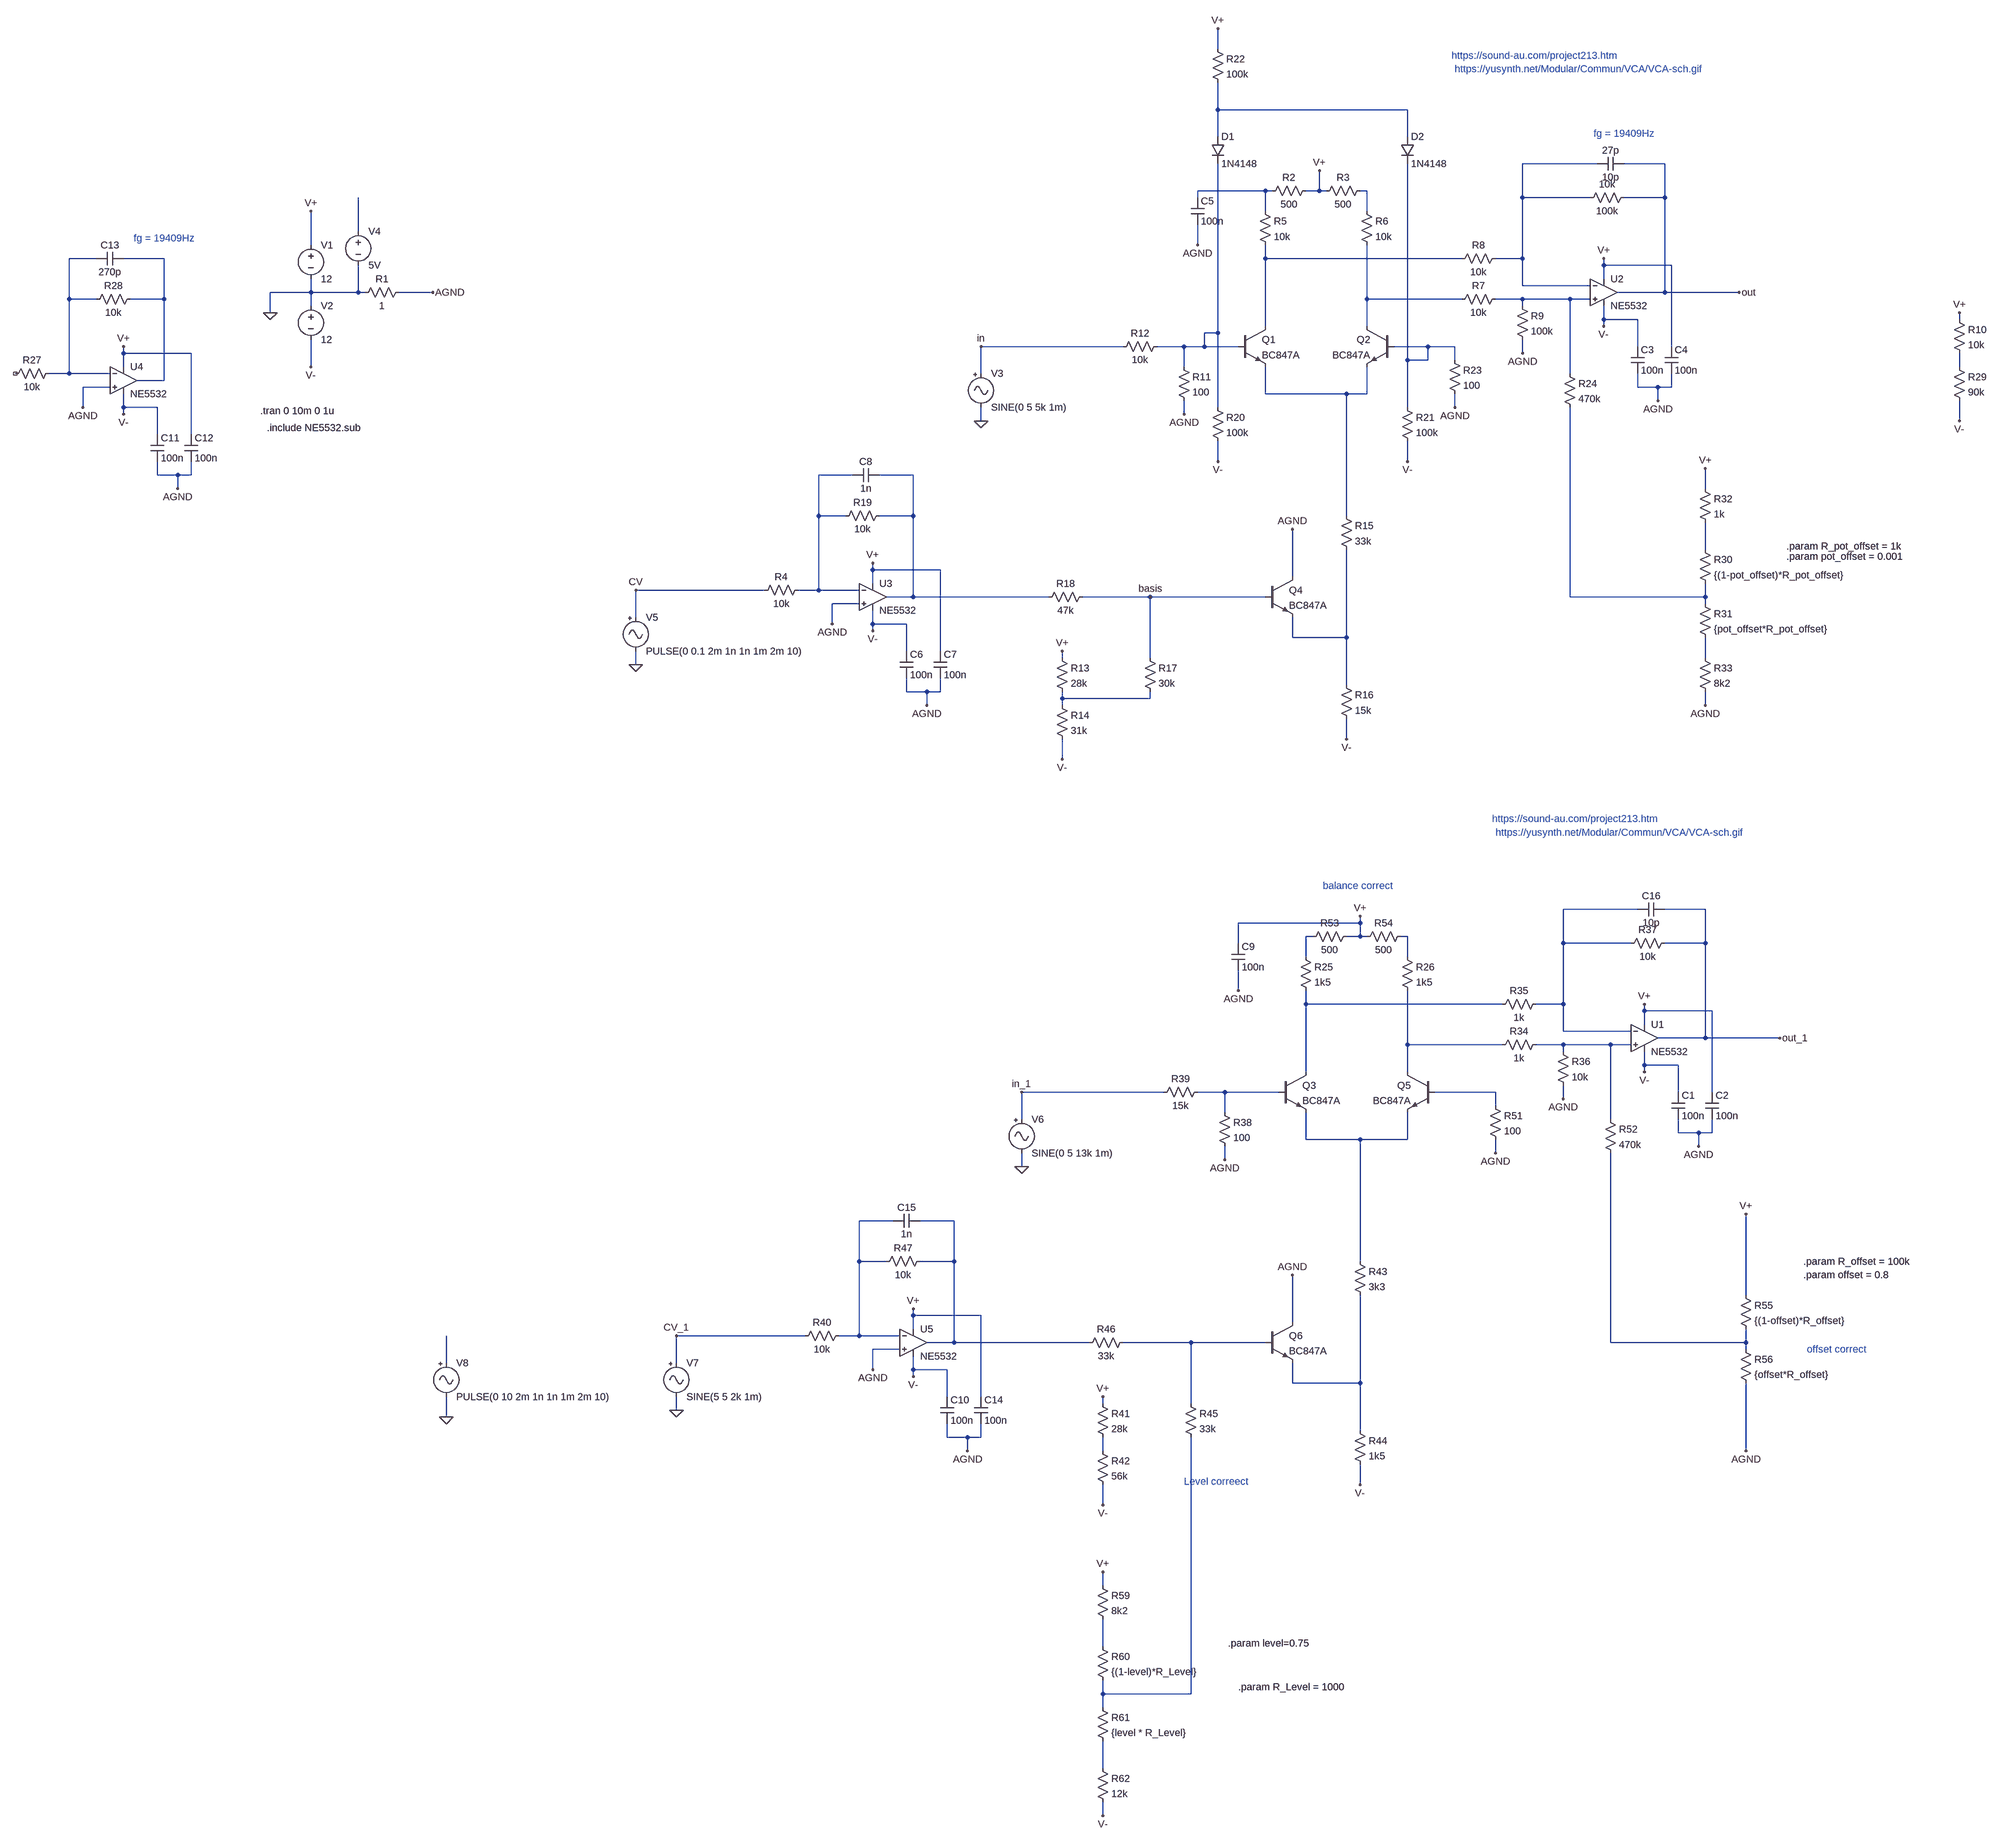
[diagram p0: schematic VCA.asc]
VCA.asc, the LTspice schematic file:
Version 4
SHEET 1 3684 4248
WIRE 1760 -416 1760 -464
WIRE 1760 -272 1760 -336
WIRE 2208 -272 1760 -272
WIRE 1760 -208 1760 -272
WIRE 2208 -208 2208 -272
WIRE 2656 -144 2480 -144
WIRE 2816 -144 2720 -144
WIRE 1872 -80 1712 -80
WIRE 1888 -80 1872 -80
WIRE 2000 -80 2000 -128
WIRE 2000 -80 1968 -80
WIRE 2016 -80 2000 -80
WIRE 2112 -80 2096 -80
WIRE 1712 -64 1712 -80
WIRE 2480 -64 2480 -144
WIRE 2640 -64 2480 -64
WIRE 2816 -64 2816 -144
WIRE 2816 -64 2720 -64
WIRE 1872 -32 1872 -80
WIRE 2112 -32 2112 -80
WIRE -272 16 -272 -64
WIRE -384 48 -384 -32
WIRE 1712 48 1712 0
WIRE -1776 80 -1840 80
WIRE -1616 80 -1712 80
WIRE 1872 80 1872 48
WIRE 2336 80 1872 80
WIRE 2480 80 2480 -64
WIRE 2480 80 2416 80
WIRE 2672 96 2672 80
WIRE 2832 96 2672 96
WIRE 2672 128 2672 96
WIRE 2480 144 2480 80
WIRE 2640 144 2480 144
WIRE -384 160 -384 128
WIRE -384 160 -480 160
WIRE -272 160 -272 96
WIRE -272 160 -384 160
WIRE -256 160 -272 160
WIRE -96 160 -176 160
WIRE 2816 160 2816 -64
WIRE 2816 160 2704 160
WIRE 2992 160 2816 160
WIRE -1840 176 -1840 80
WIRE -1776 176 -1840 176
WIRE -1616 176 -1616 80
WIRE -1616 176 -1696 176
WIRE 2112 176 2112 48
WIRE 2336 176 2112 176
WIRE 2480 176 2416 176
WIRE 2592 176 2480 176
WIRE 2640 176 2592 176
WIRE -384 192 -384 160
WIRE 2480 192 2480 176
WIRE -480 208 -480 160
WIRE 2672 224 2672 192
WIRE 2752 224 2672 224
WIRE 3616 224 3616 208
WIRE 1872 240 1872 80
WIRE 2112 240 2112 176
WIRE 2672 240 2672 224
WIRE 1760 256 1760 -144
WIRE 1760 256 1728 256
WIRE 1536 288 1200 288
WIRE 1680 288 1616 288
WIRE 1728 288 1728 256
WIRE 1728 288 1680 288
WIRE 1808 288 1728 288
WIRE 2256 288 2176 288
WIRE 2320 288 2256 288
WIRE 2752 288 2752 224
WIRE 2832 288 2832 96
WIRE -1712 304 -1712 288
WIRE -1552 304 -1712 304
WIRE 2480 304 2480 272
WIRE 2208 320 2208 -144
WIRE 2256 320 2256 288
WIRE 2256 320 2208 320
WIRE 2320 320 2320 288
WIRE -1712 336 -1712 304
WIRE -384 336 -384 272
WIRE 1680 336 1680 288
WIRE 3616 336 3616 304
WIRE -1840 352 -1840 176
WIRE -1840 352 -1888 352
WIRE -1744 352 -1840 352
WIRE 1200 352 1200 288
WIRE 2592 352 2592 176
WIRE -1616 368 -1616 176
WIRE -1616 368 -1680 368
WIRE -1744 384 -1808 384
WIRE 2752 384 2752 352
WIRE 2800 384 2752 384
WIRE 2832 384 2832 352
WIRE 2832 384 2800 384
WIRE 1872 400 1872 336
WIRE 2064 400 1872 400
WIRE 2112 400 2112 336
WIRE 2112 400 2064 400
WIRE 2800 416 2800 384
WIRE -1808 432 -1808 384
WIRE -1712 432 -1712 400
WIRE -1632 432 -1712 432
WIRE 1760 432 1760 256
WIRE 2208 432 2208 320
WIRE 2320 432 2320 400
WIRE -1712 448 -1712 432
WIRE 1680 448 1680 416
WIRE 1200 464 1200 432
WIRE 3616 464 3616 416
WIRE -1632 496 -1632 432
WIRE -1552 496 -1552 304
WIRE 1760 560 1760 512
WIRE 2208 560 2208 512
WIRE -1632 592 -1632 560
WIRE -1584 592 -1632 592
WIRE -1552 592 -1552 560
WIRE -1552 592 -1584 592
WIRE 896 592 816 592
WIRE 1040 592 960 592
WIRE -1584 624 -1584 592
WIRE 2912 624 2912 576
WIRE 816 688 816 592
WIRE 880 688 816 688
WIRE 1040 688 1040 592
WIRE 1040 688 960 688
WIRE 2064 688 2064 400
WIRE 2912 768 2912 704
WIRE 944 816 944 800
WIRE 1104 816 944 816
WIRE 1936 832 1936 720
WIRE 944 848 944 816
WIRE 688 864 384 864
WIRE 816 864 816 688
WIRE 816 864 768 864
WIRE 912 864 816 864
WIRE 1040 880 1040 688
WIRE 1040 880 976 880
WIRE 1360 880 1040 880
WIRE 1600 880 1440 880
WIRE 1872 880 1600 880
WIRE 2592 880 2592 432
WIRE 2912 880 2912 848
WIRE 2912 880 2592 880
WIRE 912 896 848 896
WIRE 2912 896 2912 880
WIRE 384 928 384 864
WIRE 848 944 848 896
WIRE 944 944 944 912
WIRE 1024 944 944 944
WIRE 944 960 944 944
WIRE 1936 976 1936 928
WIRE 2064 976 2064 768
WIRE 2064 976 1936 976
WIRE 1024 1008 1024 944
WIRE 1104 1008 1104 816
WIRE 1392 1024 1392 1008
WIRE 1600 1024 1600 880
WIRE 2912 1024 2912 976
WIRE 384 1040 384 1008
WIRE 2064 1088 2064 976
WIRE 1024 1104 1024 1072
WIRE 1072 1104 1024 1104
WIRE 1104 1104 1104 1072
WIRE 1104 1104 1072 1104
WIRE 1392 1120 1392 1104
WIRE 1600 1120 1600 1104
WIRE 1600 1120 1392 1120
WIRE 1072 1136 1072 1104
WIRE 1392 1136 1392 1120
WIRE 2912 1136 2912 1104
WIRE 2064 1216 2064 1168
WIRE 1392 1264 1392 1216
WIRE 2752 1952 2576 1952
WIRE 2912 1952 2816 1952
WIRE 2096 1984 2096 1968
WIRE 2096 1984 1808 1984
WIRE 1984 2016 1968 2016
WIRE 2096 2016 2096 1984
WIRE 2096 2016 2064 2016
WIRE 2112 2016 2096 2016
WIRE 2208 2016 2192 2016
WIRE 1808 2032 1808 1984
WIRE 2576 2032 2576 1952
WIRE 2736 2032 2576 2032
WIRE 2912 2032 2912 1952
WIRE 2912 2032 2816 2032
WIRE 1968 2064 1968 2016
WIRE 2208 2064 2208 2016
WIRE 1808 2144 1808 2096
WIRE 1968 2176 1968 2144
WIRE 2432 2176 1968 2176
WIRE 2576 2176 2576 2032
WIRE 2576 2176 2512 2176
WIRE 2768 2192 2768 2176
WIRE 2928 2192 2768 2192
WIRE 2768 2224 2768 2192
WIRE 2576 2240 2576 2176
WIRE 2736 2240 2576 2240
WIRE 2912 2256 2912 2032
WIRE 2912 2256 2800 2256
WIRE 3088 2256 2912 2256
WIRE 2208 2272 2208 2144
WIRE 2432 2272 2208 2272
WIRE 2576 2272 2512 2272
WIRE 2688 2272 2576 2272
WIRE 2736 2272 2688 2272
WIRE 2576 2288 2576 2272
WIRE 2768 2320 2768 2288
WIRE 2848 2320 2768 2320
WIRE 1968 2336 1968 2176
WIRE 2208 2336 2208 2272
WIRE 2768 2336 2768 2320
WIRE 1632 2384 1296 2384
WIRE 1776 2384 1712 2384
WIRE 1904 2384 1776 2384
WIRE 2416 2384 2272 2384
WIRE 2848 2384 2848 2320
WIRE 2928 2384 2928 2192
WIRE 2576 2400 2576 2368
WIRE 2416 2416 2416 2384
WIRE 1776 2432 1776 2384
WIRE 1296 2448 1296 2384
WIRE 2688 2448 2688 2272
WIRE 2848 2480 2848 2448
WIRE 2896 2480 2848 2480
WIRE 2928 2480 2928 2448
WIRE 2928 2480 2896 2480
WIRE 1968 2496 1968 2432
WIRE 2096 2496 1968 2496
WIRE 2208 2496 2208 2432
WIRE 2208 2496 2096 2496
WIRE 2896 2512 2896 2480
WIRE 2416 2528 2416 2496
WIRE 1776 2544 1776 2512
WIRE 1296 2560 1296 2528
WIRE 992 2688 912 2688
WIRE 1136 2688 1056 2688
WIRE 912 2784 912 2688
WIRE 976 2784 912 2784
WIRE 1136 2784 1136 2688
WIRE 1136 2784 1056 2784
WIRE 2096 2784 2096 2496
WIRE 3008 2864 3008 2672
WIRE 1040 2912 1040 2896
WIRE 1200 2912 1040 2912
WIRE 1936 2928 1936 2816
WIRE 1040 2944 1040 2912
WIRE 784 2960 480 2960
WIRE 912 2960 912 2784
WIRE 912 2960 864 2960
WIRE 1008 2960 912 2960
WIRE 1136 2976 1136 2784
WIRE 1136 2976 1072 2976
WIRE 1456 2976 1136 2976
WIRE 1696 2976 1536 2976
WIRE 1872 2976 1696 2976
WIRE 2688 2976 2688 2528
WIRE 3008 2976 3008 2944
WIRE 3008 2976 2688 2976
WIRE 1008 2992 944 2992
WIRE 3008 2992 3008 2976
WIRE -64 3024 -64 2960
WIRE 480 3024 480 2960
WIRE 944 3040 944 2992
WIRE 1040 3040 1040 3008
WIRE 1120 3040 1040 3040
WIRE 1040 3056 1040 3040
WIRE 1936 3072 1936 3024
WIRE 2096 3072 2096 2864
WIRE 2096 3072 1936 3072
WIRE 1120 3104 1120 3040
WIRE 1200 3104 1200 2912
WIRE 1488 3120 1488 3104
WIRE 1696 3120 1696 2976
WIRE 480 3136 480 3104
WIRE -64 3152 -64 3104
WIRE 2096 3184 2096 3072
WIRE 1120 3200 1120 3168
WIRE 1168 3200 1120 3200
WIRE 1200 3200 1200 3168
WIRE 1200 3200 1168 3200
WIRE 1168 3232 1168 3200
WIRE 1488 3232 1488 3200
WIRE 3008 3232 3008 3072
WIRE 2096 3312 2096 3264
WIRE 1488 3360 1488 3312
WIRE 1488 3632 1488 3600
WIRE 1488 3776 1488 3712
WIRE 1488 3888 1488 3856
WIRE 1696 3888 1696 3200
WIRE 1696 3888 1488 3888
WIRE 1488 3920 1488 3888
WIRE 1488 4064 1488 4000
WIRE 1488 4176 1488 4144
FLAG -480 208 0
FLAG -384 -32 V+
FLAG -384 336 V-
FLAG -96 160 AGND
FLAG 1200 464 0
FLAG 2672 80 V+
FLAG 2672 240 V-
FLAG 2800 416 AGND
FLAG 2480 304 AGND
FLAG 1680 448 AGND
FLAG 1712 48 AGND
FLAG 2000 -128 V+
FLAG 2992 160 out
FLAG 384 1040 0
FLAG 1200 288 in
FLAG 1936 720 AGND
FLAG 2064 1216 V-
FLAG 1392 1264 V-
FLAG 1392 1008 V+
FLAG 944 800 V+
FLAG 944 960 V-
FLAG 848 944 AGND
FLAG 1072 1136 AGND
FLAG 384 864 CV
FLAG 1760 560 V-
FLAG 2208 560 V-
FLAG 1760 -464 V+
FLAG 1600 880 basis
FLAG 2320 432 AGND
FLAG -1712 288 V+
FLAG -1712 448 V-
FLAG -1808 432 AGND
FLAG -1584 624 AGND
FLAG 3616 464 V-
FLAG 3616 208 V+
FLAG 2912 1136 AGND
FLAG 2912 576 V+
FLAG 1296 2560 0
FLAG 2768 2176 V+
FLAG 2768 2336 V-
FLAG 2896 2512 AGND
FLAG 2576 2400 AGND
FLAG 1776 2544 AGND
FLAG 1808 2144 AGND
FLAG 2096 1968 V+
FLAG 3088 2256 out_1
FLAG 480 3136 0
FLAG 1296 2384 in_1
FLAG 1936 2816 AGND
FLAG 2096 3312 V-
FLAG 1488 3360 V-
FLAG 1488 3104 V+
FLAG 1040 2896 V+
FLAG 1040 3056 V-
FLAG 944 3040 AGND
FLAG 1168 3232 AGND
FLAG 480 2960 CV_1
FLAG 2416 2528 AGND
FLAG 3008 3232 AGND
FLAG 3008 2672 V+
FLAG -64 3152 0
FLAG 1488 3600 V+
FLAG 1488 4176 V-
SYMBOL voltage -384 32 R0
WINDOW 123 0 0 Left 0
WINDOW 39 0 0 Left 0
SYMATTR InstName V1
SYMATTR Value 12
SYMBOL voltage -384 176 R0
WINDOW 123 0 0 Left 0
WINDOW 39 0 0 Left 0
SYMATTR InstName V2
SYMATTR Value 12
SYMBOL res -160 144 R90
WINDOW 0 0 56 VBottom 2
WINDOW 3 32 56 VTop 2
SYMATTR InstName R1
SYMATTR Value 1
SYMBOL Misc\\signal 1200 336 R0
WINDOW 123 0 0 Left 0
WINDOW 39 0 0 Left 0
SYMATTR InstName V3
SYMATTR Value SINE(0 5 5k 1m)
SYMBOL npn 1808 240 R0
SYMATTR InstName Q1
SYMATTR Value BC847A
SYMBOL npn 2176 240 M0
SYMATTR InstName Q2
SYMATTR Value BC847A
SYMBOL res 1856 -48 R0
SYMATTR InstName R5
SYMATTR Value 10k
SYMBOL res 2096 -48 R0
SYMATTR InstName R6
SYMATTR Value 10k
SYMBOL NE5532 2672 96 R0
SYMATTR InstName U2
SYMBOL cap 2736 288 R0
SYMATTR InstName C3
SYMATTR Value 100n
SYMBOL cap 2816 288 R0
SYMATTR InstName C4
SYMATTR Value 100n
SYMBOL res 2432 160 R90
WINDOW 0 0 56 VBottom 2
WINDOW 3 32 56 VTop 2
SYMATTR InstName R7
SYMATTR Value 10k
SYMBOL res 2432 64 R90
WINDOW 0 0 56 VBottom 2
WINDOW 3 32 56 VTop 2
SYMATTR InstName R8
SYMATTR Value 10k
SYMBOL res 2464 176 R0
SYMATTR InstName R9
SYMATTR Value 100k
SYMBOL res 2736 -80 R90
WINDOW 0 0 56 VBottom 2
WINDOW 3 32 56 VTop 2
SYMATTR InstName 10k
SYMATTR Value 100k
SYMBOL res 1664 320 R0
SYMATTR InstName R11
SYMATTR Value 100
SYMBOL res 1632 272 R90
WINDOW 0 0 56 VBottom 2
WINDOW 3 32 56 VTop 2
SYMATTR InstName R12
SYMATTR Value 10k
SYMBOL voltage -272 0 R0
WINDOW 123 0 0 Left 0
WINDOW 39 0 0 Left 0
SYMATTR InstName V4
SYMATTR Value 5V
SYMBOL cap 1696 -64 R0
SYMATTR InstName C5
SYMATTR Value 100n
SYMBOL Misc\\signal 384 912 R0
WINDOW 123 0 0 Left 0
WINDOW 39 0 0 Left 0
SYMATTR InstName V5
SYMATTR Value PULSE(0 0.1 2m 1n 1n 1m 2m 10)
SYMBOL res 784 848 R90
WINDOW 0 0 56 VBottom 2
WINDOW 3 32 56 VTop 2
SYMATTR InstName R4
SYMATTR Value 10k
SYMBOL res 1376 1008 R0
SYMATTR InstName R13
SYMATTR Value 28k
SYMBOL res 1376 1120 R0
SYMATTR InstName R14
SYMATTR Value 31k
SYMBOL npn 1872 832 R0
SYMATTR InstName Q4
SYMATTR Value BC847A
SYMBOL res 2048 672 R0
SYMATTR InstName R15
SYMATTR Value 33k
SYMBOL res 2048 1072 R0
SYMATTR InstName R16
SYMATTR Value 15k
SYMBOL res 1584 1008 R0
SYMATTR InstName R17
SYMATTR Value 30k
SYMBOL res 1456 864 R90
WINDOW 0 0 56 VBottom 2
WINDOW 3 32 56 VTop 2
SYMATTR InstName R18
SYMATTR Value 47k
SYMBOL NE5532 944 816 R0
SYMATTR InstName U3
SYMBOL res 976 672 R90
WINDOW 0 0 56 VBottom 2
WINDOW 3 32 56 VTop 2
SYMATTR InstName R19
SYMATTR Value 10k
SYMBOL cap 1008 1008 R0
SYMATTR InstName C6
SYMATTR Value 100n
SYMBOL cap 1088 1008 R0
SYMATTR InstName C7
SYMATTR Value 100n
SYMBOL diode 1744 -208 R0
SYMATTR InstName D1
SYMATTR Value 1N4148
SYMBOL diode 2192 -208 R0
SYMATTR InstName D2
SYMATTR Value 1N4148
SYMBOL res 1744 416 R0
SYMATTR InstName R20
SYMATTR Value 100k
SYMBOL res 2192 416 R0
SYMATTR InstName R21
SYMATTR Value 100k
SYMBOL res 1744 -432 R0
SYMATTR InstName R22
SYMATTR Value 100k
SYMBOL res 2304 304 R0
SYMATTR InstName R23
SYMATTR Value 100
SYMBOL cap 960 576 R90
WINDOW 0 0 32 VBottom 2
WINDOW 3 32 32 VTop 2
SYMATTR InstName C8
SYMATTR Value 1n
SYMBOL cap 2720 -160 R90
WINDOW 0 0 32 VBottom 2
WINDOW 3 32 32 VTop 2
SYMATTR InstName 27p
SYMATTR Value 10p
SYMBOL res 2576 336 R0
SYMATTR InstName R24
SYMATTR Value 470k
SYMBOL NE5532 -1712 304 R0
SYMATTR InstName U4
SYMBOL res -1872 336 R90
WINDOW 0 0 56 VBottom 2
WINDOW 3 32 56 VTop 2
SYMATTR InstName R27
SYMATTR Value 10k
SYMBOL res -1680 160 R90
WINDOW 0 0 56 VBottom 2
WINDOW 3 32 56 VTop 2
SYMATTR InstName R28
SYMATTR Value 10k
SYMBOL cap -1648 496 R0
SYMATTR InstName C11
SYMATTR Value 100n
SYMBOL cap -1568 496 R0
SYMATTR InstName C12
SYMATTR Value 100n
SYMBOL cap -1712 64 R90
WINDOW 0 0 32 VBottom 2
WINDOW 3 32 32 VTop 2
SYMATTR InstName C13
SYMATTR Value 270p
SYMBOL res 1984 -96 R90
WINDOW 0 0 56 VBottom 2
WINDOW 3 32 56 VTop 2
SYMATTR InstName R2
SYMATTR Value 500
SYMBOL res 2112 -96 R90
WINDOW 0 0 56 VBottom 2
WINDOW 3 32 56 VTop 2
SYMATTR InstName R3
SYMATTR Value 500
SYMBOL res 3600 208 R0
SYMATTR InstName R10
SYMATTR Value 10k
SYMBOL res 3600 320 R0
SYMATTR InstName R29
SYMATTR Value 90k
SYMBOL res 2896 752 R0
SYMATTR InstName R30
SYMATTR Value {(1-pot_offset)*R_pot_offset}
SYMBOL res 2896 880 R0
SYMATTR InstName R31
SYMATTR Value {pot_offset*R_pot_offset}
SYMBOL res 2896 608 R0
SYMATTR InstName R32
SYMATTR Value 1k
SYMBOL res 2896 1008 R0
SYMATTR InstName R33
SYMATTR Value 8k2
SYMBOL Misc\\signal 1296 2432 R0
WINDOW 123 0 0 Left 0
WINDOW 39 0 0 Left 0
SYMATTR InstName V6
SYMATTR Value SINE(0 5 13k 1m)
SYMBOL npn 1904 2336 R0
SYMATTR InstName Q3
SYMATTR Value BC847A
SYMBOL npn 2272 2336 M0
SYMATTR InstName Q5
SYMATTR Value BC847A
SYMBOL res 1952 2048 R0
SYMATTR InstName R25
SYMATTR Value 1k5
SYMBOL res 2192 2048 R0
SYMATTR InstName R26
SYMATTR Value 1k5
SYMBOL NE5532 2768 2192 R0
SYMATTR InstName U1
SYMBOL cap 2832 2384 R0
SYMATTR InstName C1
SYMATTR Value 100n
SYMBOL cap 2912 2384 R0
SYMATTR InstName C2
SYMATTR Value 100n
SYMBOL res 2528 2256 R90
WINDOW 0 0 56 VBottom 2
WINDOW 3 32 56 VTop 2
SYMATTR InstName R34
SYMATTR Value 1k
SYMBOL res 2528 2160 R90
WINDOW 0 0 56 VBottom 2
WINDOW 3 32 56 VTop 2
SYMATTR InstName R35
SYMATTR Value 1k
SYMBOL res 2560 2272 R0
SYMATTR InstName R36
SYMATTR Value 10k
SYMBOL res 2832 2016 R90
WINDOW 0 0 56 VBottom 2
WINDOW 3 32 56 VTop 2
SYMATTR InstName R37
SYMATTR Value 10k
SYMBOL res 1760 2416 R0
SYMATTR InstName R38
SYMATTR Value 100
SYMBOL res 1728 2368 R90
WINDOW 0 0 56 VBottom 2
WINDOW 3 32 56 VTop 2
SYMATTR InstName R39
SYMATTR Value 15k
SYMBOL cap 1792 2032 R0
SYMATTR InstName C9
SYMATTR Value 100n
SYMBOL Misc\\signal 480 3008 R0
WINDOW 123 0 0 Left 0
WINDOW 39 0 0 Left 0
SYMATTR InstName V7
SYMATTR Value SINE(5 5 2k 1m)
SYMBOL res 880 2944 R90
WINDOW 0 0 56 VBottom 2
WINDOW 3 32 56 VTop 2
SYMATTR InstName R40
SYMATTR Value 10k
SYMBOL res 1472 3104 R0
SYMATTR InstName R41
SYMATTR Value 28k
SYMBOL res 1472 3216 R0
SYMATTR InstName R42
SYMATTR Value 56k
SYMBOL npn 1872 2928 R0
SYMATTR InstName Q6
SYMATTR Value BC847A
SYMBOL res 2080 2768 R0
SYMATTR InstName R43
SYMATTR Value 3k3
SYMBOL res 2080 3168 R0
SYMATTR InstName R44
SYMATTR Value 1k5
SYMBOL res 1680 3104 R0
SYMATTR InstName R45
SYMATTR Value 33k
SYMBOL res 1552 2960 R90
WINDOW 0 0 56 VBottom 2
WINDOW 3 32 56 VTop 2
SYMATTR InstName R46
SYMATTR Value 33k
SYMBOL NE5532 1040 2912 R0
SYMATTR InstName U5
SYMBOL res 1072 2768 R90
WINDOW 0 0 56 VBottom 2
WINDOW 3 32 56 VTop 2
SYMATTR InstName R47
SYMATTR Value 10k
SYMBOL cap 1104 3104 R0
SYMATTR InstName C10
SYMATTR Value 100n
SYMBOL cap 1184 3104 R0
SYMATTR InstName C14
SYMATTR Value 100n
SYMBOL res 2400 2400 R0
SYMATTR InstName R51
SYMATTR Value 100
SYMBOL cap 1056 2672 R90
WINDOW 0 0 32 VBottom 2
WINDOW 3 32 32 VTop 2
SYMATTR InstName C15
SYMATTR Value 1n
SYMBOL cap 2816 1936 R90
WINDOW 0 0 32 VBottom 2
WINDOW 3 32 32 VTop 2
SYMATTR InstName C16
SYMATTR Value 10p
SYMBOL res 2672 2432 R0
SYMATTR InstName R52
SYMATTR Value 470k
SYMBOL res 2080 2000 R90
WINDOW 0 0 56 VBottom 2
WINDOW 3 32 56 VTop 2
SYMATTR InstName R53
SYMATTR Value 500
SYMBOL res 2208 2000 R90
WINDOW 0 0 56 VBottom 2
WINDOW 3 32 56 VTop 2
SYMATTR InstName R54
SYMATTR Value 500
SYMBOL res 2992 2848 R0
SYMATTR InstName R55
SYMATTR Value {(1-offset)*R_offset}
SYMBOL res 2992 2976 R0
SYMATTR InstName R56
SYMATTR Value {offset*R_offset}
SYMBOL Misc\\signal -64 3008 R0
WINDOW 123 0 0 Left 0
WINDOW 39 0 0 Left 0
SYMATTR InstName V8
SYMATTR Value PULSE(0 10 2m 1n 1n 1m 2m 10)
SYMBOL res 1472 3616 R0
SYMATTR InstName R59
SYMATTR Value 8k2
SYMBOL res 1472 3760 R0
SYMATTR InstName R60
SYMATTR Value {(1-level)*R_Level}
SYMBOL res 1472 3904 R0
SYMATTR InstName R61
SYMATTR Value {level * R_Level}
SYMBOL res 1472 4048 R0
SYMATTR InstName R62
SYMATTR Value 12k
TEXT -504 440 Left 2 !.tran 0 10m 0 1u
TEXT -488 480 Left 2 !.include NE5532.sub
TEXT 2312 -400 Left 2 ;https://sound-au.com/project213.htm
TEXT 2320 -368 Left 2 ;https://yusynth.net/Modular/Commun/VCA/VCA-sch.gif
TEXT 2648 -216 Left 2 ;fg = 19409Hz
TEXT -1688 32 Left 2 ;fg = 19409Hz
TEXT 3104 784 Left 2 !.param pot_offset = 0.001
TEXT 3104 760 Left 2 !.param R_pot_offset = 1k
TEXT 2408 1696 Left 2 ;https://sound-au.com/project213.htm
TEXT 2416 1728 Left 2 ;https://yusynth.net/Modular/Commun/VCA/VCA-sch.gif
TEXT 1680 3304 Left 2 ;Level correect
TEXT 3152 2992 Left 2 ;offset correct
TEXT 2008 1896 Left 2 ;balance correct
TEXT 1784 3768 Left 2 !.param level=0.75
TEXT 1808 3872 Left 2 !.param R_Level = 1000
TEXT 3144 2784 Left 2 !.param R_offset = 100k
TEXT 3144 2816 Left 2 !.param offset = 0.8

The netlist it stands for:
* VCA.asc
V1 V+ 0 12
V2 0 V- 12
R1 AGND 0 1
V3 in 0 SINE(0 5 5k 1m)
Q1 N008 N011 N014 0 BC847A
Q2 N009 N012 N014 0 BC847A
R5 N003 N008 10k
R6 N004 N009 10k
* U2: NE5532 (symbol NE5532 not available, pins judged from their places): In+=N010 In-=N002 V+=V+ V-=V- OUT=out
C3 V- AGND 100n
C4 V+ AGND 100n
R7 N010 N009 10k
R8 N002 N008 10k
R9 N010 AGND 100k
R§10k out N002 100k
R11 N011 AGND 100
R12 N011 in 10k
V4 N005 0 5V
C5 N003 AGND 100n
V5 CV 0 PULSE(0 0.1 2m 1n 1n 1m 2m 10)
R4 N015 CV 10k
R13 V+ N021 28k
R14 N021 V- 31k
Q4 AGND basis N019 0 BC847A
R15 N014 N019 33k
R16 N019 V- 15k
R17 basis N021 30k
R18 basis N016 47k
* U3: NE5532 (symbol NE5532 not available, pins judged from their places): In+=AGND In-=N015 V+=V+ V-=V- OUT=N016
R19 N016 N015 10k
C6 V- AGND 100n
C7 V+ AGND 100n
D1 N001 N011 1N4148
D2 N001 N012 1N4148
R20 N011 V- 100k
R21 N012 V- 100k
R22 V+ N001 100k
R23 N012 AGND 100
C8 N016 N015 1n
C§27p out N002 10p
R24 N010 N018 470k
* U4: NE5532 (symbol NE5532 not available, pins judged from their places): In+=AGND In-=N006 V+=V+ V-=V- OUT=N007
R27 N006 NC_01 10k
R28 N007 N006 10k
C11 V- AGND 100n
C12 V+ AGND 100n
C13 N007 N006 270p
R2 V+ N003 500
R3 N004 V+ 500
R10 V+ N013 10k
R29 N013 V- 90k
R30 N017 N018 {(1-pot_offset)*R_pot_offset}
R31 N018 N020 {pot_offset*R_pot_offset}
R32 V+ N017 1k
R33 N020 AGND 8k2
V6 in_1 0 SINE(0 5 13k 1m)
Q3 N025 N028 N030 0 BC847A
Q5 N026 N029 N030 0 BC847A
R25 N023 N025 1k5
R26 N024 N026 1k5
* U1: NE5532 (symbol NE5532 not available, pins judged from their places): In+=N027 In-=N022 V+=V+ V-=V- OUT=out_1
C1 V- AGND 100n
C2 V+ AGND 100n
R34 N027 N026 1k
R35 N022 N025 1k
R36 N027 AGND 10k
R37 out_1 N022 10k
R38 N028 AGND 100
R39 N028 in_1 15k
C9 V+ AGND 100n
V7 CV_1 0 SINE(5 5 2k 1m)
R40 N031 CV_1 10k
R41 V+ N037 28k
R42 N037 V- 56k
Q6 AGND N033 N036 0 BC847A
R43 N030 N036 3k3
R44 N036 V- 1k5
R45 N033 N039 33k
R46 N033 N032 33k
* U5: NE5532 (symbol NE5532 not available, pins judged from their places): In+=AGND In-=N031 V+=V+ V-=V- OUT=N032
R47 N032 N031 10k
C10 V- AGND 100n
C14 V+ AGND 100n
R51 N029 AGND 100
C15 N032 N031 1n
C16 out_1 N022 10p
R52 N027 N034 470k
R53 V+ N023 500
R54 N024 V+ 500
R55 V+ N034 {(1-offset)*R_offset}
R56 N034 AGND {offset*R_offset}
V8 N035 0 PULSE(0 10 2m 1n 1n 1m 2m 10)
R59 V+ N038 8k2
R60 N038 N039 {(1-level)*R_Level}
R61 N039 N040 {level * R_Level}
R62 N040 V- 12k
.model D D
.lib standard.dio
.model NPN NPN
.model PNP PNP
.lib standard.bjt
.tran 0 10m 0 1u
.include NE5532.sub
* https://sound-au.com/project213.htm
* https://yusynth.net/Modular/Commun/VCA/VCA-sch.gif
* fg = 19409Hz
* fg = 19409Hz
.param pot_offset = 0.001
.param R_pot_offset = 1k
* https://sound-au.com/project213.htm
* https://yusynth.net/Modular/Commun/VCA/VCA-sch.gif
* Level correect
* offset correct
* balance correct
.param level=0.75
.param R_Level = 1000
.param R_offset = 100k
.param offset = 0.8
.backanno
.end